# EAGLE design tinkertechLED (EAGLE 8.7.0)
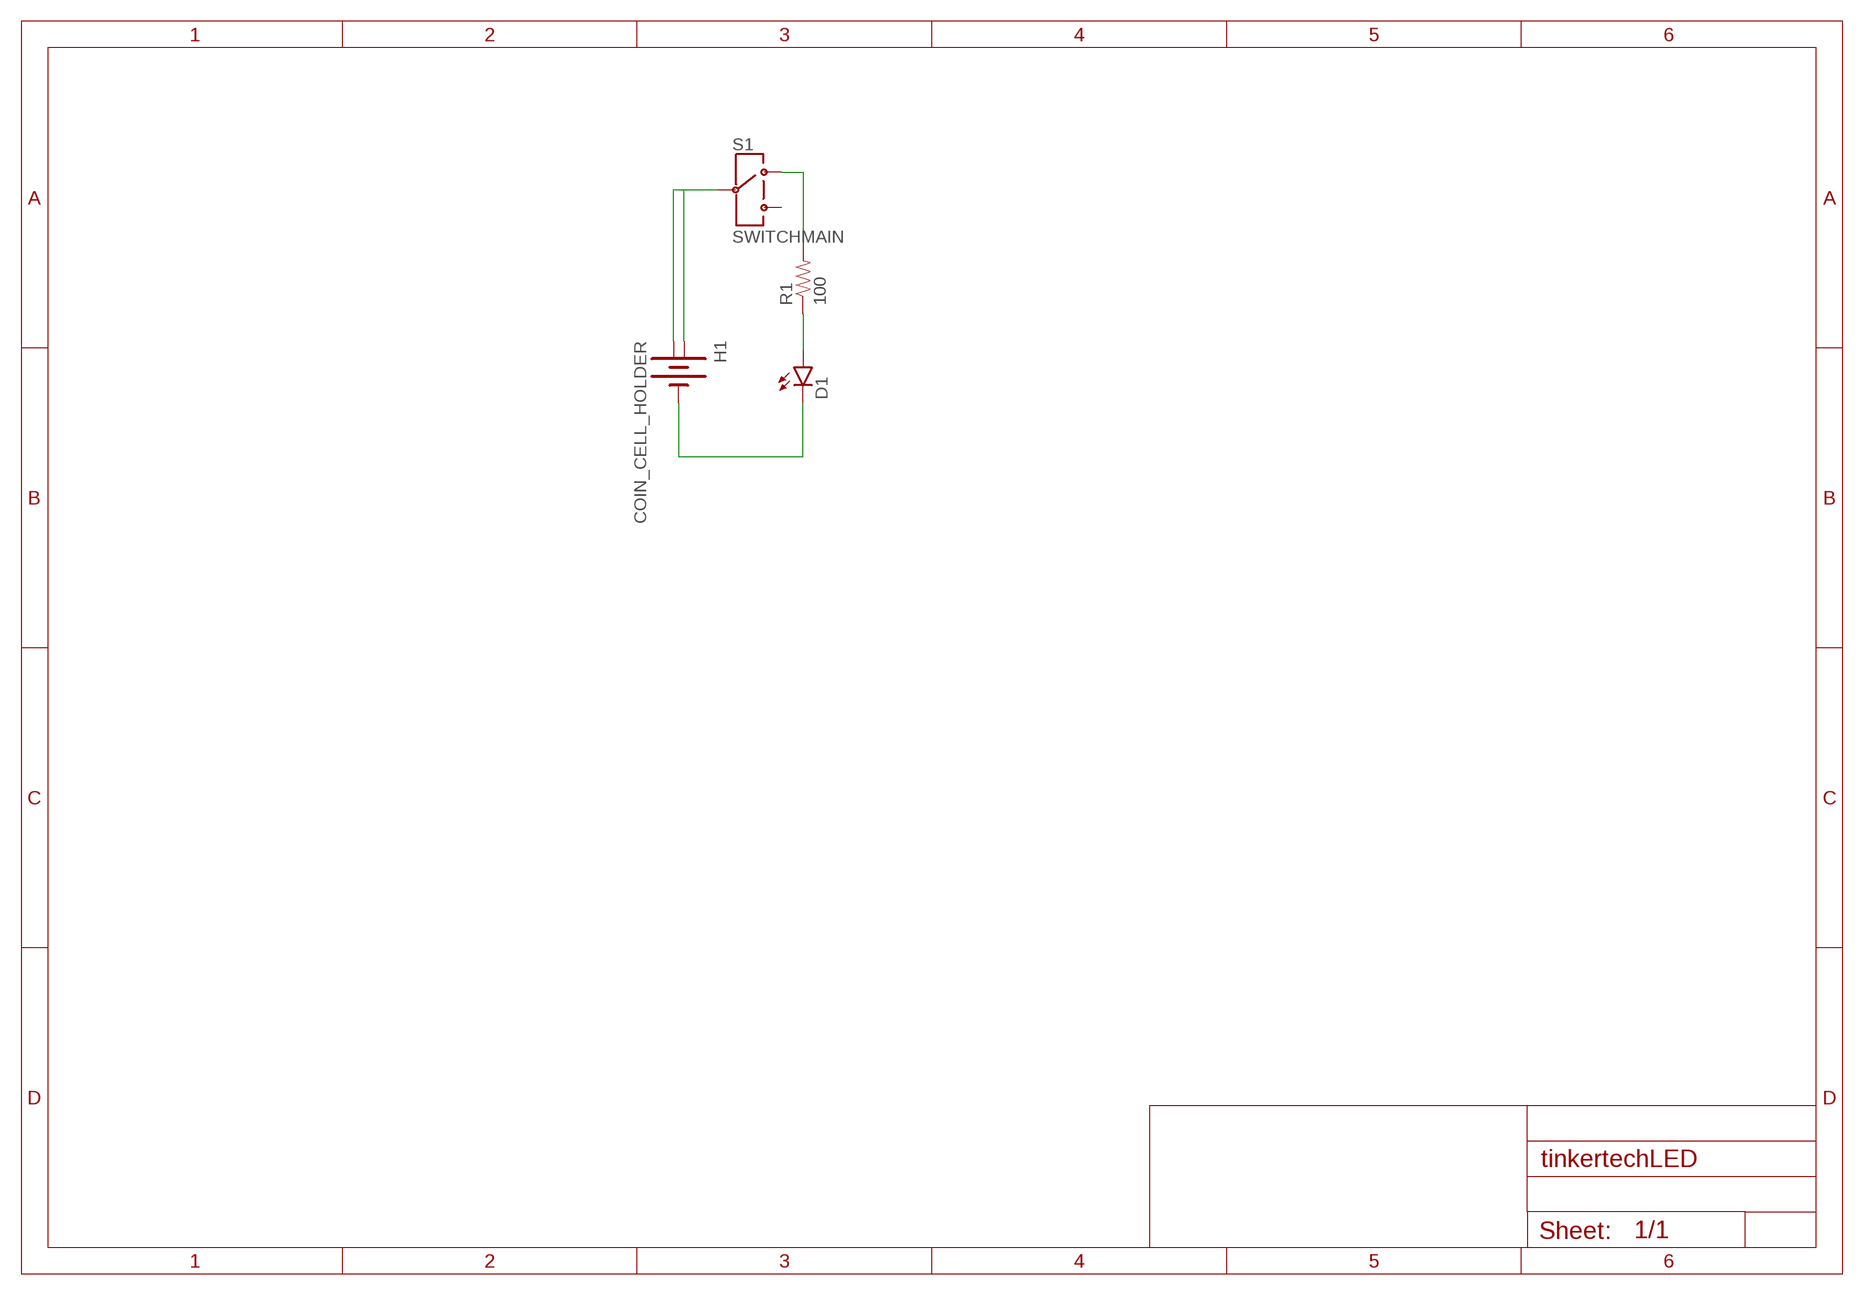
[diagram p0: schematic, sheet 1]

## Parts
D1  LED5MM  [LED5MM]
H1  COIN_CELL_HOLDER  [COIN_CELL_HOLDER]
R1  100  RESISTORKIT  [AXIAL-0.3-KIT]
S1  SWITCHMAIN  [SWITCH]

## Nets
N$1: H1.P$2(+) H1.P$3(++) S1.P$2(C)
N$2: D1.K(C) H1.P$1(-)
N$3: R1.P$2 S1.P$1
N$4: D1.A R1.P$1
Unconnected: S1.P$3

## Library data of the parts
D1 = modified-sparkfun-parts:LED: LEDs Standard schematic elements and footprints for 5mm, 3mm, 1206, and 0603 sized LEDs. 5mm - Spark Fun Electronics SKU : COM-00529 (and others)
H1 = modified-sparkfun-parts:COIN_CELL_HOLDER: 12mm coin cell battery holder (glider SMD THRU-HOLE)
R1 = SparkFun-Passives:RESISTOR: Resistor Basic schematic elements and footprints for 0603, 1206, and PTH resistors.
S1 = modified-sparkfun-parts:SWITCH: A small switch

## Net classes
0 default: width 0.254 mm, clearance 0.178 mm

## Board
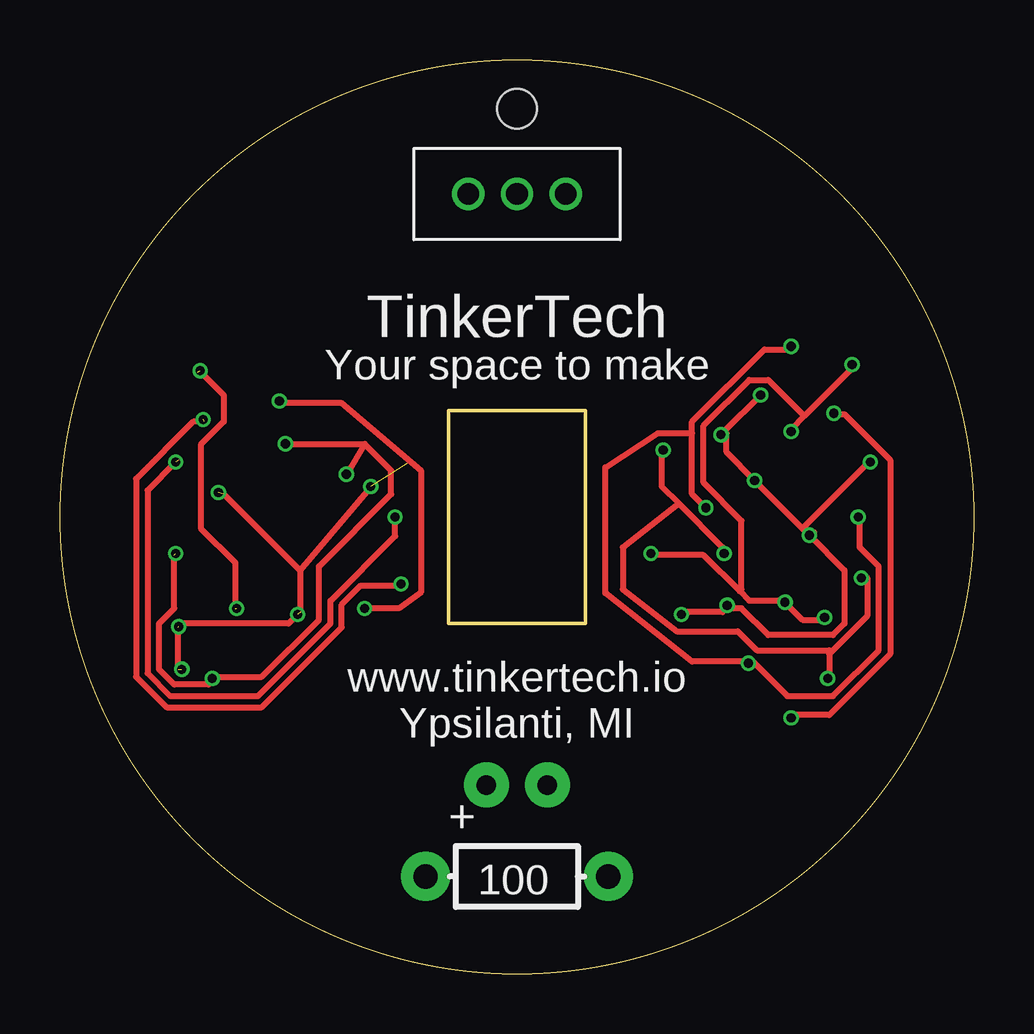
[diagram p1: board, top side]
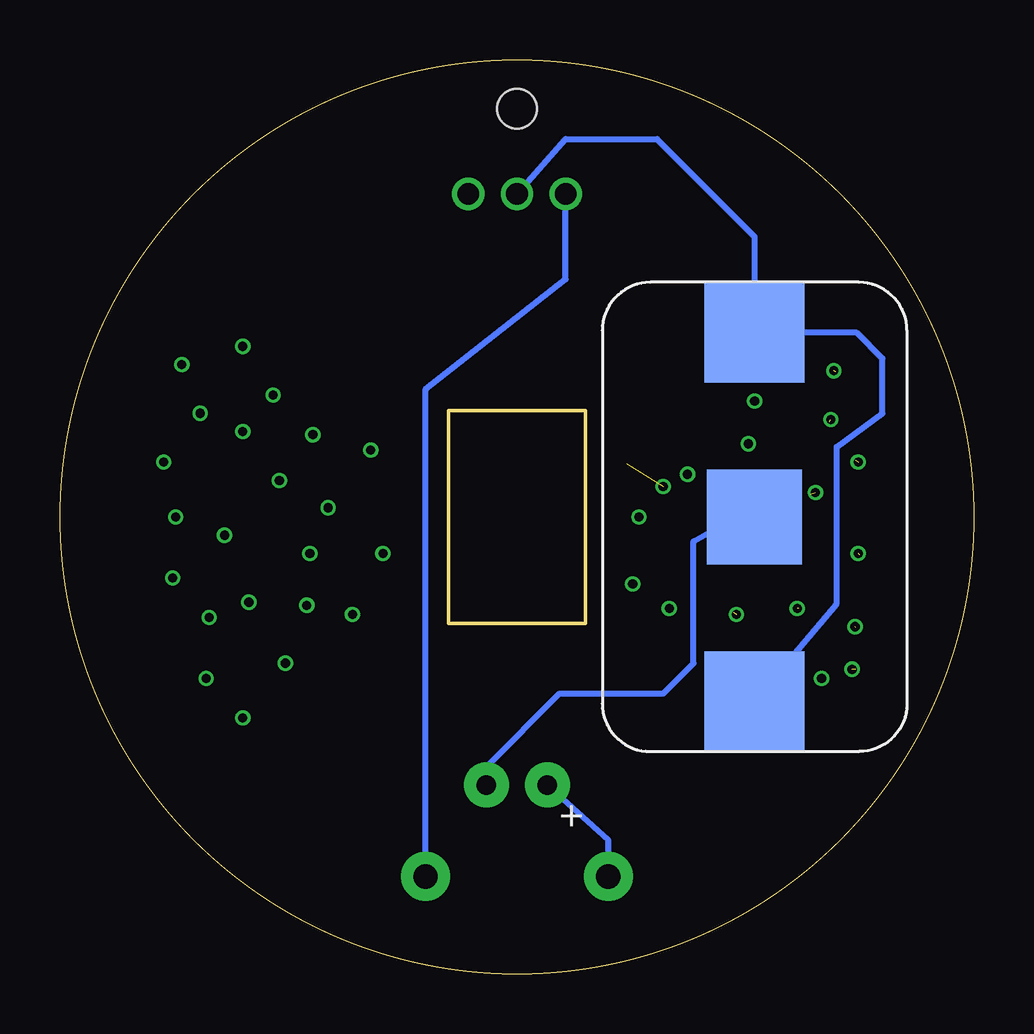
[diagram p2: board, bottom side, seen from below]

Size 38.1 x 38.1 mm. Coordinates in mm from the lower left corner, seen from the top.
Outline: 16.19,23.5 16.19,14.61 21.91,14.61 21.91,23.5 16.19,23.5
Outline: circle at 19.05,19.05 radius 19.05
Copper layers (1*16): Top 0.035559375mm / dielectric 1.6mm / Bottom 0.035559375mm
Design rules "oshpark-2layer *": minimum track width 6mil, minimum drill 10mil, track to track 7mil, track to pad 7mil, pad to pad 7mil, via to via 7mil, smd to smd 7mil, copper to edge 15mil, drill to drill 6mil, minimum pad ring 5mil, minimum via ring 5mil, stop-mask expansion 2.5mil, vias tented up to drill 0mil, thermal gap 10mil
Holes 1.65 mm at 19.05,36.07

### Footprints (pad centres in the part's own frame; a part is rotated, then mirrored left to right if it is on the bottom)
LED5MM = drill 0.813 pad 1.88: A -1.27,0; K 1.27,0
COIN_CELL_HOLDER = smd 3.96 x 3.96: P$1 0,0 | smd 4.17 x 4.17: P$2 7.685,0; P$3 -7.685,0
AXIAL-0.3-KIT = drill 1.016 pad 2.032: P$1 -3.81,0; P$2 3.81,0
SWITCH = drill 0.9: P$1 0,2.032; P$2 0,0; P$3 0,-2.032

### Placement (x,y rotation side)
D1  19.05,7.87 180 bottom
H1  9.14,19.05 270 bottom
R1  19.05,4.06 0 top
S1  19.05,32.51 90 top

### Tracks (layer width: path | path; a pad name or v marks a point on that pad's centre or on a via)
L1  (via drill 0.38)  (1 unrouted)
  Top 0.254: v13.97,19.05 13.97,18.26 11.27,15.56 11.27,14.61 8.26,11.59 4.6,11.59 3.65,12.54 3.65,20.16 v4.83,21.34
L2  (via drill 0.38)  (1 unrouted)
  Top 0.254: 6.06,23.02 v5.97,23.11 | 6.03,23.02 5.56,23.02 3.17,20.64 3.17,12.38 4.45,11.11 8.41,11.11 11.75,14.45 11.75,15.4 12.54,16.19 14.13,16.19 v14.22,16.26
L3  (via drill 0.38)
  Top 0.254: v12.7,15.24 14.13,15.24 15.05,15.91 15.05,20.99 11.72,23.81 9.21,23.81 v9.14,23.88
L4  (via drill 0.38)  (1 unrouted)
  Top 0.254: 4.95,17.46 v4.83,17.53 | v9.4,22.1 12.7,22.09 | 12.7,22.09 v11.94,20.83 | 4.76,17.46 4.76,15.24 4.13,14.61 4.13,12.7 4.76,12.06 6.19,12.06 6.35,12.22 v6.35,12.32 6.35,12.38 8.41,12.38 10.79,14.76 10.79,16.99 13.81,20 13.81,20.98 12.7,22.09
L5  (via drill 0.38)  (5 unrouted)
  Top 0.254: 4.95,12.7 v5.08,12.7 | 6.7,20 v6.6,20.07 | 4.92,12.7 4.92,14.45 | 10,16.83 10,15.08 v9.91,14.99 9.53,14.61 4.92,14.61 v4.95,14.48 | 6.83,20 10,16.83 | 10,16.83 12.92,20.26 v12.95,20.32
L6  (via drill 0.38)  (2 unrouted)
  Top 0.254: 7.33,15.24 v7.37,15.24 | 7.3,15.24 7.3,17.14 5.87,18.57 5.87,22.07 6.83,23.02 6.83,24.13 5.87,25.08 v5.84,25.15
N$1
  Bottom 0.254: H1.P$2 5.71,15.43 5.71,21.97 3.81,23.37 3.81,25.65 4.89,26.73 H1.P$3 9.14,30.73 13.21,34.8 17.02,34.8 S1.P$2
N$2
  Bottom 0.254: D1.K 20.32,8.64 17.27,11.68 12.95,11.68 11.68,12.95 11.68,18.03 9.91,19.05 H1.P$1
N$3
  Bottom 0.254: R1.P$2 22.86,24.38 17.02,28.96 S1.P$1
N$4
  Bottom 0.254: R1.P$1 15.24,5.59 D1.A
T1  (via drill 0.38)
  Top 0.254: 32.15,13.41 33.66,14.92 33.66,16.51 v33.4,16.51 | 32.15,13.41 32.07,13.34 32.07,12.38 v32,12.32 | 25.8,19.61 25.08,20.32 25.08,21.59 v25.15,21.84 | 25.8,19.61 27.62,17.78 v27.69,17.53 | 25.8,19.61 23.46,17.78 23.46,16.03 25.72,14.29 28.26,14.29 29.05,13.49 32.07,13.49 32.15,13.41
T2  (via drill 0.38)
  Top 0.254: 31.43,18.41 v31.24,18.29 | 27.7,22.62 27.75,22.42 v27.56,22.48 | 27.7,22.62 v29.21,24.13 | v25.91,14.99 26.04,15.08 27.62,15.08 27.94,15.4 v27.81,15.37 27.94,15.24 28.42,15.24 29.53,14.13 32.23,14.13 32.7,14.61 32.7,16.83 v31.24,18.29 | v31.24,18.29 30.96,18.57 | 30.96,18.57 v28.96,20.57 27.78,21.75 27.78,22.54 27.7,22.62 | 30.96,18.57 33.66,21.27 v33.78,21.34
T3  (via drill 0.38)
  Top 0.254: 31.04,23.26 33.02,25.24 v33.02,25.4 | 31.04,23.26 30.48,22.7 v30.48,22.61 | v31.88,14.86 31.91,14.76 30.96,14.76 v30.23,15.49 30.16,15.56 28.73,15.56 28.34,15.95 | 28.34,15.95 26.83,17.46 24.77,17.46 v24.64,17.53 | 31.04,23.26 29.53,24.77 28.73,24.77 26.83,22.86 26.83,20.48 28.42,18.89 28.42,16.03 28.34,15.95
T4  (via drill 0.38)
  Top 0.254: 26.35,22.54 26.35,20 v26.92,19.43 | 26.35,22.54 26.35,23.02 29.37,26.04 30.48,26.04 v30.48,26.16 | v33.27,19.05 33.34,19.05 33.34,17.78 34.13,16.99 34.13,13.49 32.23,11.59 30.32,11.59 28.89,13.02 v28.7,12.95 28.57,13.02 26.35,13.02 22.73,15.88 22.73,21.11 24.92,22.54 26.35,22.54
T5  (via drill 0.38)
  Top 0.254: 32.38,23.5 v32.26,23.37 32.38,23.34 32.7,23.34 34.61,21.43 34.61,13.34 32.07,10.79 30.48,10.79 v30.48,10.67

### Text on the board
tPlace: TinkerTech | Your space to make | www.tinkertech.io / Ypsilanti, MI | +
tDocu: CUTOUT